# EAGLE design CV Power-Pause LED Mod PCB v1.2 (EAGLE 9.1.0)
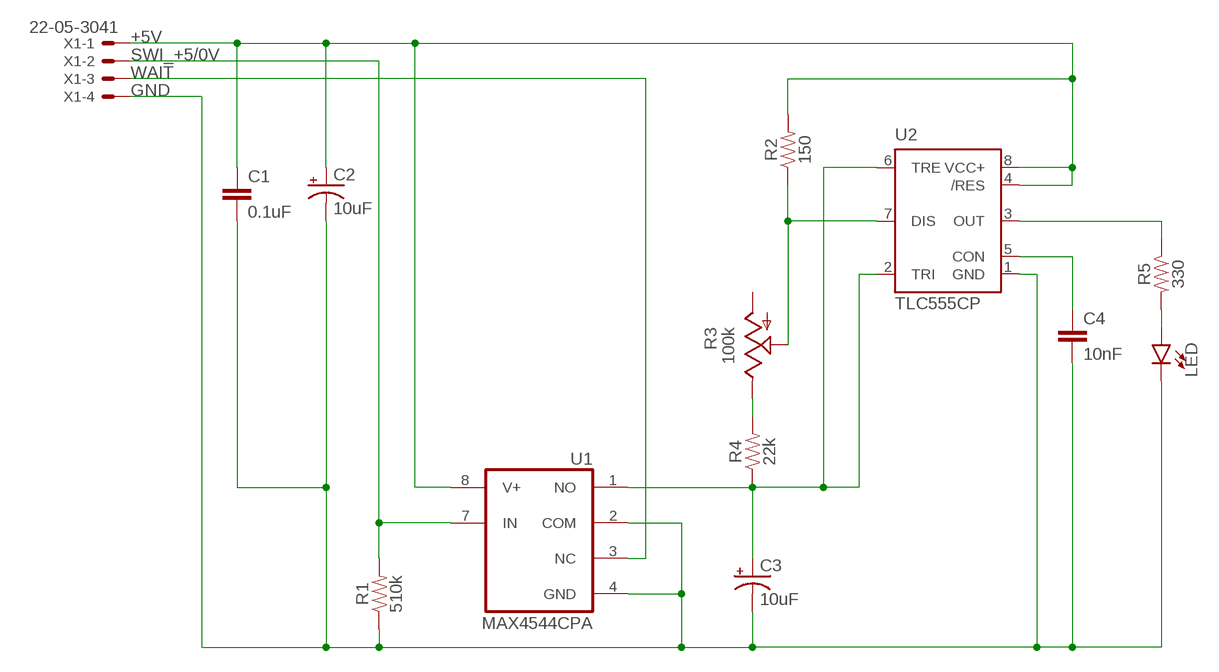
[diagram p0: schematic, sheet 1]

## Parts
C1  0.1uF  CAPPTH2  [CAP-PTH-SMALL2]
C2  10uF  CPOL-USE2.5-6  [E2,5-6]
C3  10uF  CPOL-USE2.5-6  [E2,5-6]
C4  10nF  CAPPTH2  [CAP-PTH-SMALL2]
LED  LED5MM  [LED_5MM]
R1  510k  RESISTORAXIAL-0.3  [AXIAL-0.3]
R2  150  RESISTORAXIAL-0.3  [AXIAL-0.3]
R3  100k  TRIM_US-CT6  [CT6]
R4  22k  RESISTORAXIAL-0.3  [AXIAL-0.3]
R5  330  RESISTORAXIAL-0.3  [AXIAL-0.3]
U1  MAX4544CPA  [DIP08]
U2  TLC555CP  555P  [DIP08]
X1  22-05-3041  [22-05-3041]

## Nets
+5V: C1.1 C2.+ R2.P$2 U1.8(V+) U2.4(/RES) U2.8(VCC+) X1.1
GND: C1.2 C2.- C3.- C4.2 LED.K(C) R1.P$1 U1.2(COM) U1.4(GND) U2.1(GND) X1.4
N$1: LED.A R5.P$2
N$2: C4.1 U2.5(CON)
N$3: R2.P$1 R3.S U2.7(DIS)
N$4: R5.P$1 U2.3(OUT)
N$5: R3.E R4.P$2
N$6: C3.+ R4.P$1 U1.1(NO) U2.2(TRI) U2.6(TRE)
SWI_+5/0V: R1.P$2 U1.7(IN) X1.2
WAIT: U1.3(NC) X1.3
Unconnected: R3.A

## Library data of the parts
C1 C4 = SparkFun-Capacitors:CAP: Capacitor Standard 0603 ceramic capacitor, and 0.1" leaded capacitor.
C2 C3 = rcl:CPOL-US: POLARIZED CAPACITOR, American symbol; SPICEPREFIX: C
LED = SparkFun-LED:LED: LED (Generic) Standard schematic elements and footprints for 5mm, 3mm, 1206, and 0603 sized LEDs. Generic LEDs with no color specified.
R1 R2 R4 R5 = SparkFun-Resistors:RESISTOR: Generic Resistor Package
R3 = pot:TRIM_US-: POTENTIOMETER
U1 = ASAmaxim:MAX4544CPA: ANALOG SWITCH
U2 = SparkFun-IC-Special-Function:555: General purpose bipolar Timer Datasheet <http://www.sparkfun.com/datasheets/Components/General/ne555.pdf> SparkFun Products SparkFun SparkPunk Sequencer Kit <https://www.sparkfun.com/products/12707> (KIT-12707) Storefront Component: 555 Timer <https://www.sparkfun.com/products/9273> (COM-09273) Two parts valid for production: VFP: IC-11930 (M7555 PTH) VFP: IC-09173 (555 PTH) - Preferred; PROD_ID: IC-09173; PROD_ID_ALT: IC-09173; VALUE: 555
X1 = ASAcon-molex:22-05-3041: .100" (2.54mm) Right Angle Header - 4 Pin; MF: MOLEX; MPN: 22-05-3041

## Net classes
0 default: width 0.254 mm, clearance 0.254 mm

## Board
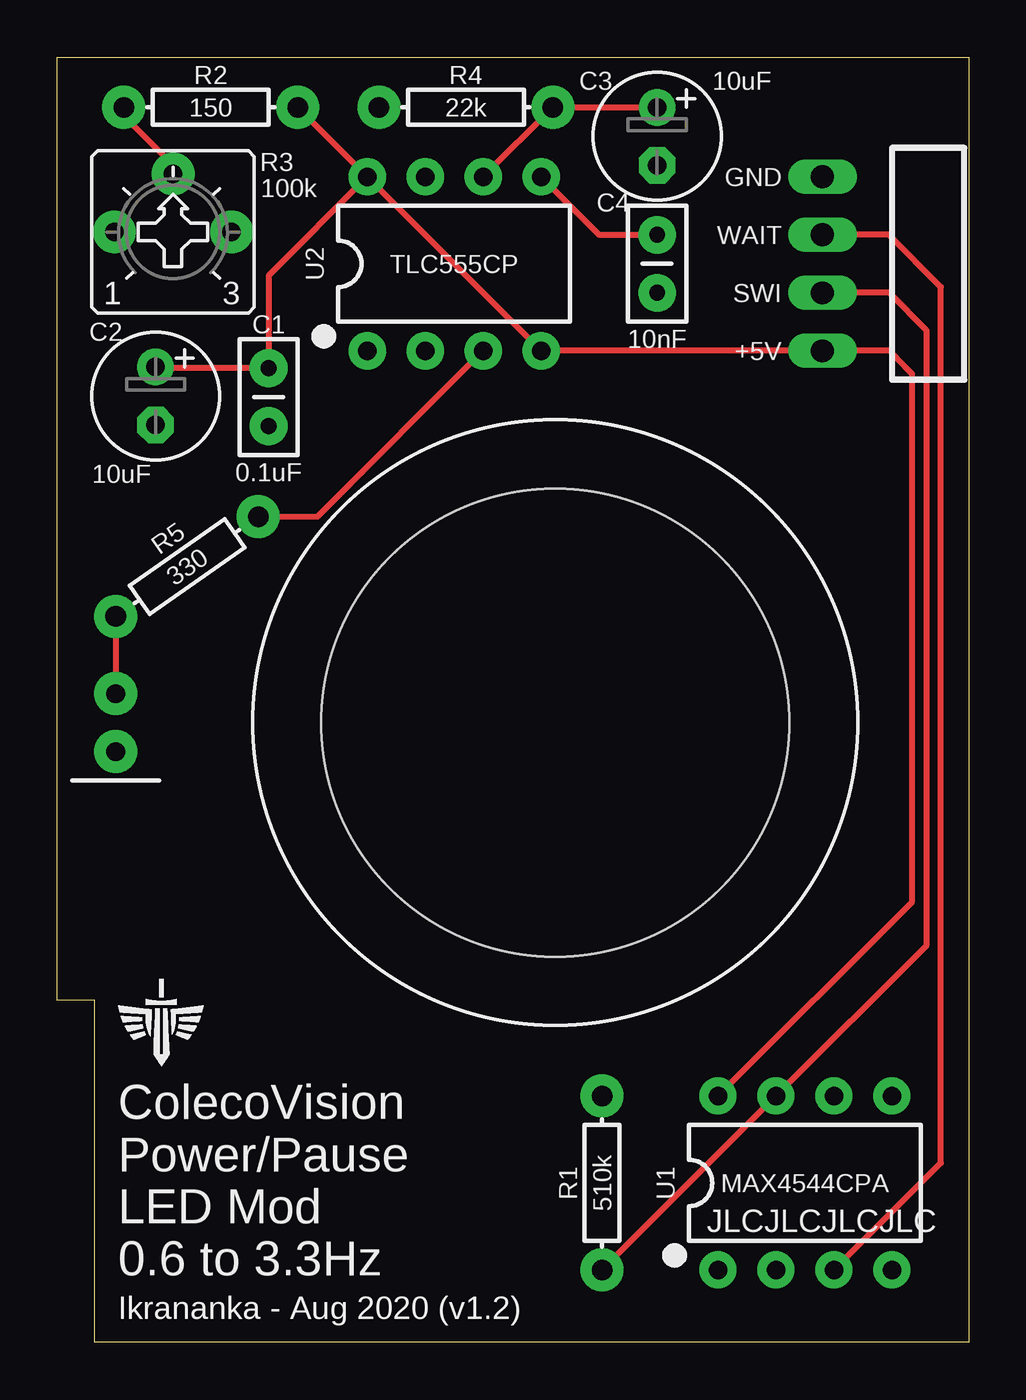
[diagram p1: board, top side]
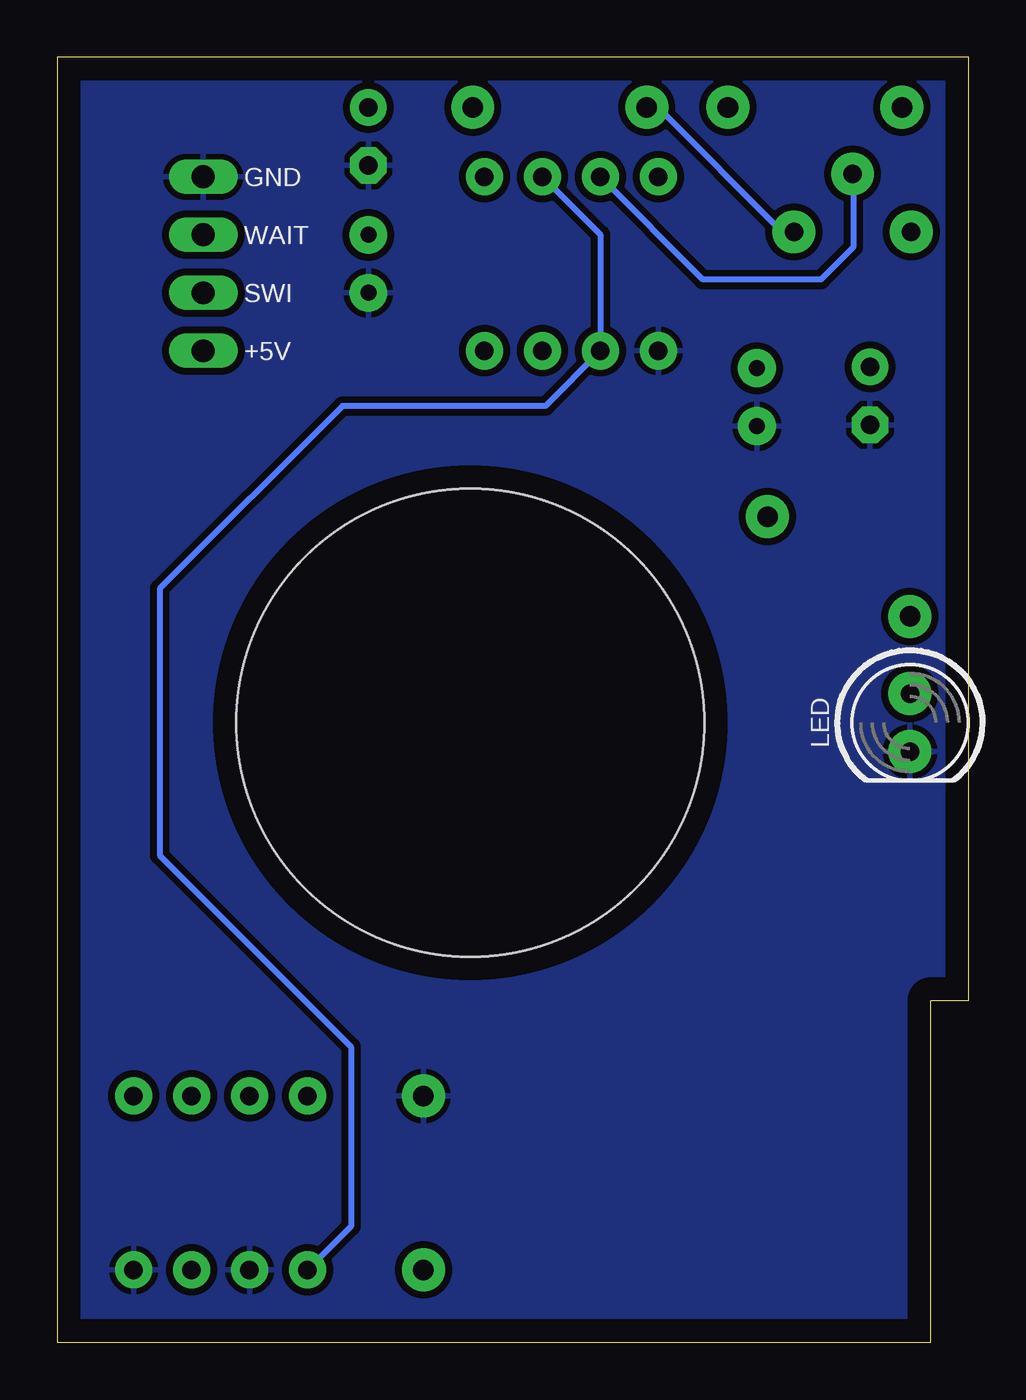
[diagram p2: board, bottom side, seen from below]

Size 39.93 x 56.3 mm. Coordinates in mm from the lower left corner, seen from the top.
Outline: 1.65,0 1.65,14.99 0,14.99 0,56.3 39.93,56.3 39.93,0 1.65,0
Copper layers (1*16): Top 0.035mm / dielectric 1.5mm / Bottom 0.035mm
Design rules "default": minimum track width 6mil, minimum drill 0.35mm, track to track 6mil, track to pad 6mil, pad to pad 6mil, via to via 6mil, smd to smd 6mil, copper to edge 40mil, drill to drill 6mil, minimum pad ring 10mil, minimum via ring 8mil, stop-mask expansion 4mil, vias tented up to drill 0mil, thermal gap 10mil
Holes 20.5 mm at 21.82,27.15

### Footprints (pad centres in the part's own frame; a part is rotated, then mirrored left to right if it is on the bottom)
CAP-PTH-SMALL2 = drill 0.7 pad 1.651: 1 0,0; 2 2.54,0
E2,5-6 = drill 0.813 pad 1.6: + -1.27,0 | drill 0.813 pad 1.6 octagon: - 1.27,0
LED_5MM = drill 0.813 pad 1.88: A -1.27,0; K 1.27,0
AXIAL-0.3 = drill 0.9 pad 1.88: P$1 -3.81,0; P$2 3.81,0
CT6 = drill 0.813 pad 1.88: A -2.565,0; E 2.565,0; S 0,2.54
DIP08 = drill 0.813 pad 1.626: 1 -3.81,-3.81; 2 -1.27,-3.81; 3 1.27,-3.81; 4 3.81,-3.81; 5 3.81,3.81; 6 1.27,3.81; 7 -1.27,3.81; 8 -3.81,3.81
22-05-3041 = drill 1 long: 1 -3.81,0; 2 -1.27,0; 3 1.27,0; 4 3.81,0

### Placement (x,y rotation side)
C1  9.27,42.67 270 top
C2  4.32,41.46 270 top
C3  26.29,52.83 270 top
C4  26.29,48.51 270 top
LED  2.57,27.15 270 bottom
R1  23.88,6.99 270 top
R2  6.73,54.1 0 top
R3  5.08,48.64 0 top
R4  17.91,54.1 180 top
R5  5.69,33.99 215 top
U1  32.77,6.99 0 top
U2  17.4,47.24 0 top
X1  33.53,47.24 90 top

### Tracks (layer width: path | path; a pad name or v marks a point on that pad's centre or on a via)
+5V
  Top 0.254: U1.8 37.47,19.3 37.47,42.42 37.15,42.74 36.45,43.43 X1.1 U2.4 16.13,48.51 U2.8 | U2.8 9.27,46.74 C1.1 4.37,42.67 C2.+ | R2.P$2 U2.8
GND
  pour Bottom (isolate 0.305): -0.51,56.77 -0.51,-0.51 40.26,-0.51 40.26,56.77
N$1
  Top 0.254: R5.P$2 LED.A | LED.A
N$2
  Top 0.254: U2.5 23.75,48.51 C4.1
N$3
  Top 0.254: R3.S 5.08,51.56 2.92,53.72 R2.P$1
  Bottom 0.254: U2.7 11.63,46.56 6.46,46.56 5.05,47.97 5.05,51.16 R3.S
N$4
  Top 0.254: U2.3 11.41,36.17 R5.P$1
N$5
  Bottom 0.254: R3.E 8.15,48.64 13.61,54.1 R4.P$2
N$6
  Top 0.254: U2.6 R4.P$1 C3.+
  Bottom 0.254: U2.6 16.13,48.51 U2.2 18.54,41.02 27.43,41.02 35.43,33.02 35.43,21.34 27.05,12.95 27.05,5.08 U1.1
SWI_+5/0V
  Top 0.254: R1.P$2 U1.7 38.1,17.4 38.1,44.32 36.45,45.97 X1.2
WAIT
  Top 0.254: U1.3 38.72,7.86 38.72,46.23 36.43,48.51 X1.3

### Text on the board
tPlace: ColecoVision / Power/Pause / LED Mod / 0.6 to 3.3Hz | Ikrananka - Aug 2020 (v1.2)
tNames: GND | WAIT | SWI | +5V | JLCJLCJLCJLC
bNames: GND | WAIT | SWI | +5V